# EAGLE design kbd (EAGLE 6.3)
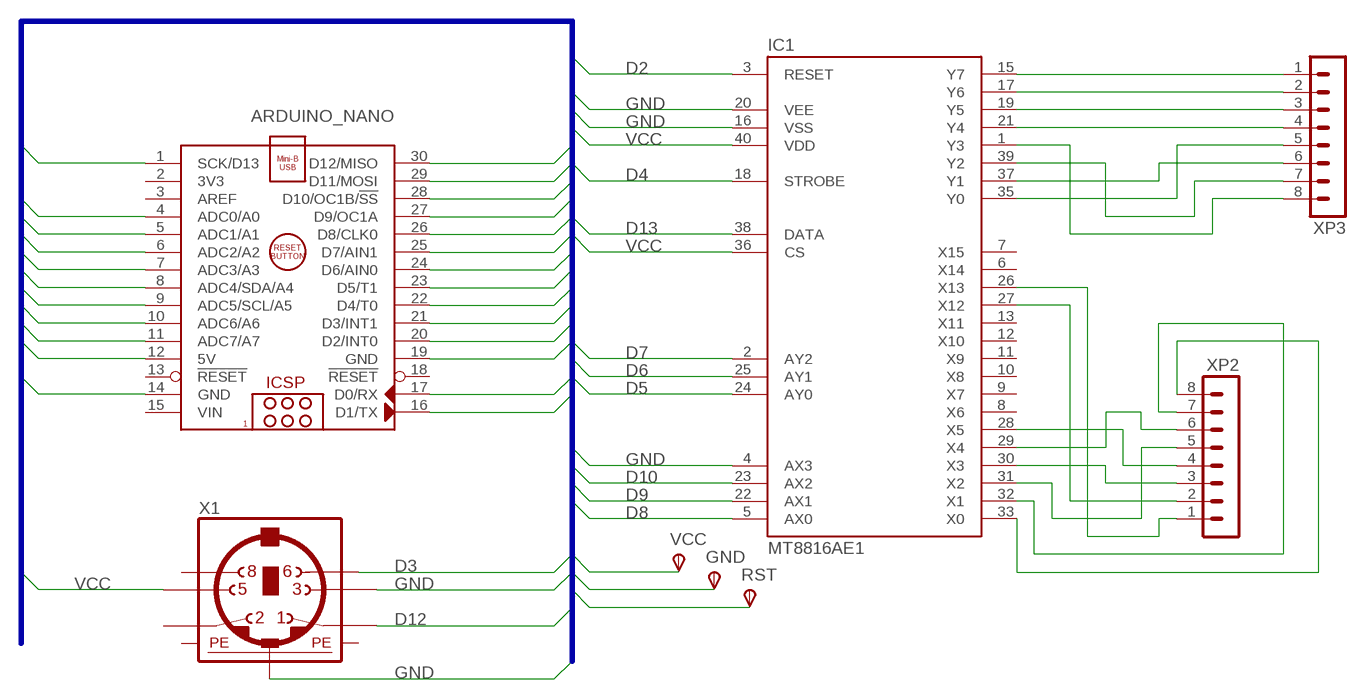
[diagram p0: schematic, sheet 1]

## Parts
ARDUINO_NANO  ARDUINO_NANO  [ARDUINO_NANO]
GND  TPSPAD1-13  [P1-13]
IC1  MT8816AE1  [DIL40]
RST  TPSPAD1-13  [P1-13]
VCC  TPSPAD1-13  [P1-13]
X1  MINI_DIN_6  [M_DIN6]
XP2  MA08-1  [MA08-1]
XP3  MA08-1  [MA08-1]

## Nets
A0: ARDUINO_NANO.4(ADC0/A0) RST.TP(PP)
A1: ARDUINO_NANO.5(ADC1/A1)
A2: ARDUINO_NANO.6(ADC2/A2)
A3: ARDUINO_NANO.7(ADC3/A3)
A4: ARDUINO_NANO.8(ADC4/SDA/A4)
A5: ARDUINO_NANO.9(ADC5/SCL/A5)
A6: ARDUINO_NANO.10(ADC6/A6)
A7: ARDUINO_NANO.11(ADC7/A7)
D0: ARDUINO_NANO.17(D0/RX)
D1: ARDUINO_NANO.16(D1/TX)
D2: ARDUINO_NANO.20(D2/INT0) IC1.3(RESET)
D3: ARDUINO_NANO.21(D3/INT1) X1.6
D4: ARDUINO_NANO.22(D4/T0) IC1.18(STROBE)
D5: ARDUINO_NANO.23(D5/T1) IC1.24(AY0)
D6: ARDUINO_NANO.24(D6/AIN0) IC1.25(AY1)
D7: ARDUINO_NANO.25(D7/AIN1) IC1.2(AY2)
D8: ARDUINO_NANO.26(D8/CLK0) IC1.5(AX0)
D9: ARDUINO_NANO.27(D9/OC1A) IC1.22(AX1)
D10: ARDUINO_NANO.28(D10/OC1B/!SS) IC1.23(AX2)
D11: ARDUINO_NANO.29(D11/MOSI)
D12: ARDUINO_NANO.30(D12/MISO) X1.1
D13: ARDUINO_NANO.1(SCK/D13) IC1.38(DATA)
GND: ARDUINO_NANO.14(GND) ARDUINO_NANO.19(GND) GND.TP(PP) IC1.4(AX3) IC1.16(VSS) IC1.20(VEE) X1.3 X1.SH2(PE2)
N$1: IC1.15(Y7) XP3.1
N$2: IC1.17(Y6) XP3.2
N$3: IC1.19(Y5) XP3.3
N$4: IC1.21(Y4) XP3.4
N$5: IC1.35(Y0) XP3.5
N$6: IC1.37(Y1) XP3.6
N$7: IC1.39(Y2) XP3.7
N$8: IC1.1(Y3) XP3.8
N$9: IC1.27(X12) XP2.2
N$10: IC1.30(X3) XP2.3
N$11: IC1.28(X5) XP2.4
N$12: IC1.31(X2) XP2.5
N$13: IC1.29(X4) XP2.6
N$14: IC1.32(X1) XP2.7
N$15: IC1.33(X0) XP2.8
N$16: IC1.26(X13) XP2.1
VCC: ARDUINO_NANO.12(5V) IC1.36(CS) IC1.40(VDD) VCC.TP(PP) X1.5
Unconnected: ARDUINO_NANO.2(3V3) ARDUINO_NANO.3(AREF) ARDUINO_NANO.13(!RESET) ARDUINO_NANO.18(!RESET) IC1.6(X14) IC1.7(X15) IC1.8(X6) IC1.9(X7) IC1.10(X8) IC1.11(X9) IC1.12(X10) IC1.13(X11) X1.2 X1.8

## Buses
D[0..13],A[0..7],VCC,GND

## Power pins joined to a net without a drawn wire
PE1: X1.SH1(PE1)
PE3: X1.SH3(PE3)
VIN: ARDUINO_NANO.15(VIN)

## Library data of the parts
ARDUINO_NANO = ArduinoNanoV30:ARDUINO_NANO: Arduino Nano V3.0 Module Overview: The Arduino Nano is a small, complete, and breadboard-friendly board based on the ATmega328 (Arduino Nano 3.x) or ATmega168 (Arduino Nano 2.x). It has more or less the same functionality of the Arduino Duemilanove, but in a different package. It lacks only a DC power jack, and works with a Mini-B USB cable instead of a standard one. The Nano was designed and is being produced by Gravitech <http://www.gravitech.us/arna30wiatp.html>. General specifications: Item Value Microcontroller Atmel ATmega168 or ATmega328 Operating Voltage (logic level) 5 V Input Voltage (recommended) 7-12 V Input Voltage (limits) 6-20 V Digital I/O Pins 14 (of which 6 provide PWM output) Analog Input Pins 8 DC Current per I/O Pin 40 mA Flash Memory 16 KB (ATmega168) or 32 KB (ATmega328) of which 2 KB used by bootloader SRAM 1 KB (ATmega168) or 2 KB (ATmega328) EEPROM 512 bytes (ATmega168) or 1 KB (ATmega328) Clock Speed 16 MHz Dimensions (Inches) 0.73" x 1.70" Dimensions (mm) 18mm x 45mm Overall height About 9 mm (not including pins) Weigth 5 g Power: The Arduino Nano can be powered via the Mini-B USB connection, 6-20V unregulated external power supply (pin 30), or 5V regulated external power supply (pin 27). The power source is automatically selected to the highest voltage source. Memory: The ATmega168 has 16 KB of flash memory for storing code (of which 2 KB is used for the bootloader); the ATmega328 has 32 KB, (also with 2 KB used for the bootloader). The ATmega168 has 1 KB of SRAM and 512 bytes of EEPROM (which can be read and written with the EEPROM library); the ATmega328 has 2 KB of SRAM and 1 KB of EEPROM. Input and Output: Each of the 14 digital pins on the Nano can be used as an input or output, using pinMode(), digitalWrite(), and digitalRead() functions. They operate at 5 volts. Each pin can provide or receive a maximum of 40 mA and has an internal pull-up resistor (disconnected by default) of 20-50 kOhms. In addition, some pins have specialized functions. Visit Arduino - ArduinoBoardNano <https://www.arduino.cc/en/Main/ArduinoBoardNano>
GND RST VCC = testpad:TPS: TEST PIN
IC1 = MT8816:MT8816: 8x16 Analog Switch Array
X1 = mini_din:MINI_DIN_6
XP2 XP3 = con-lstb:MA08-1: PIN HEADER; OC_FARNELL: unknown; OC_NEWARK: unknown

## Board
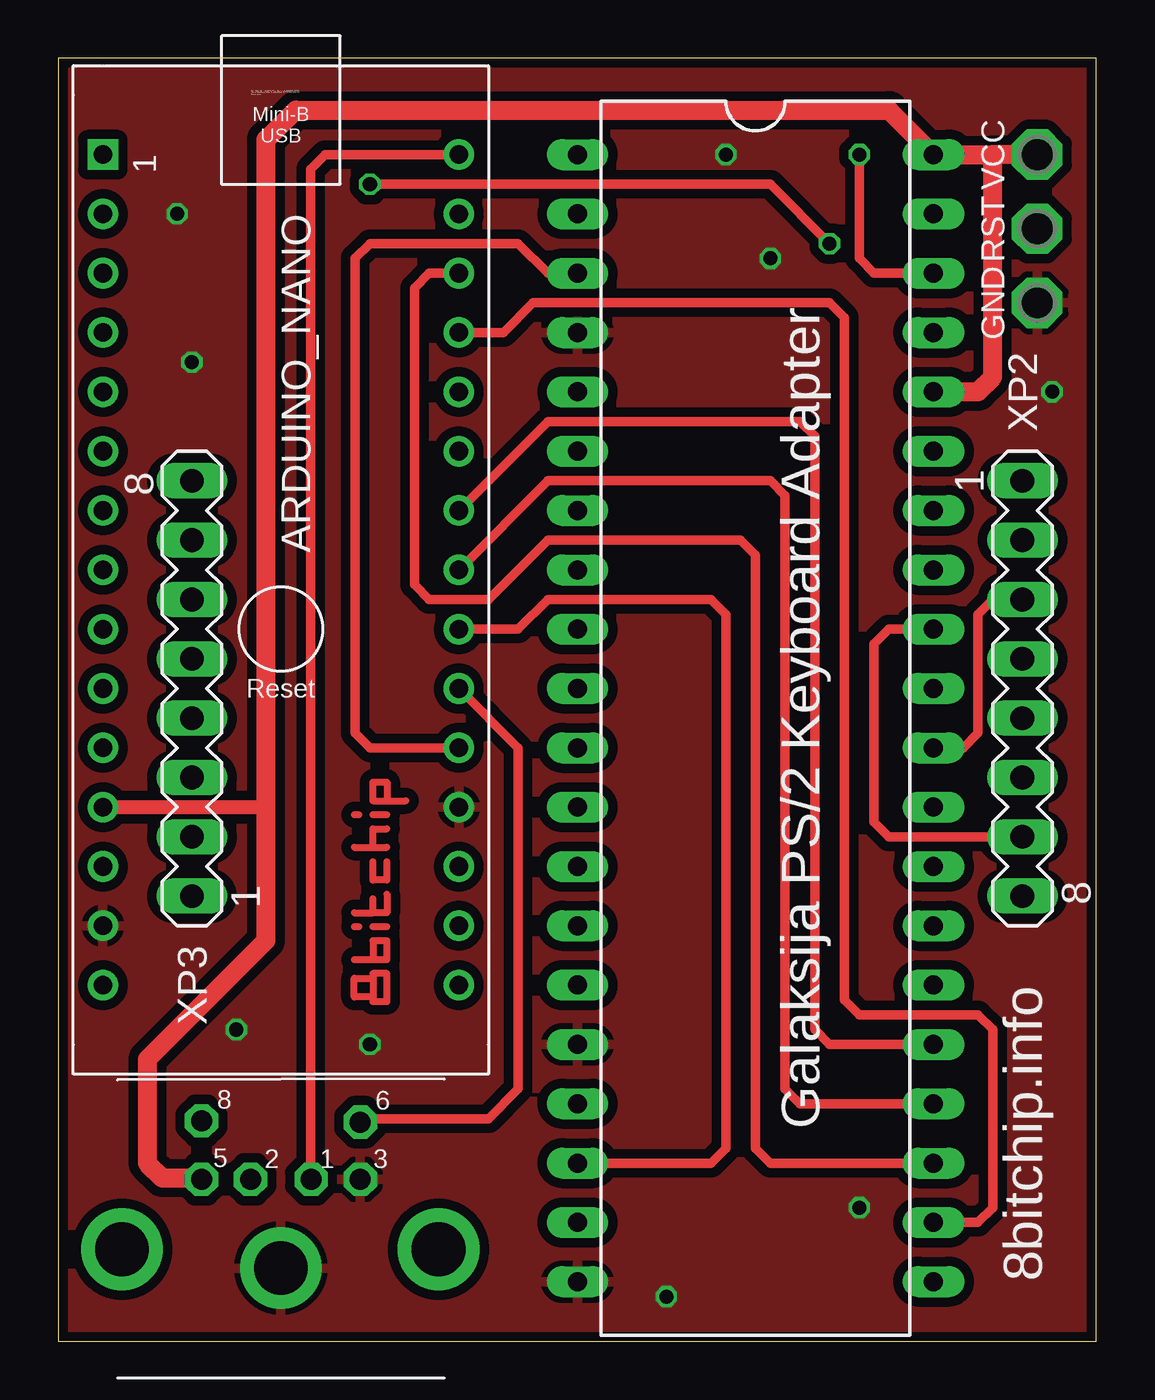
[diagram p1: board, top side]
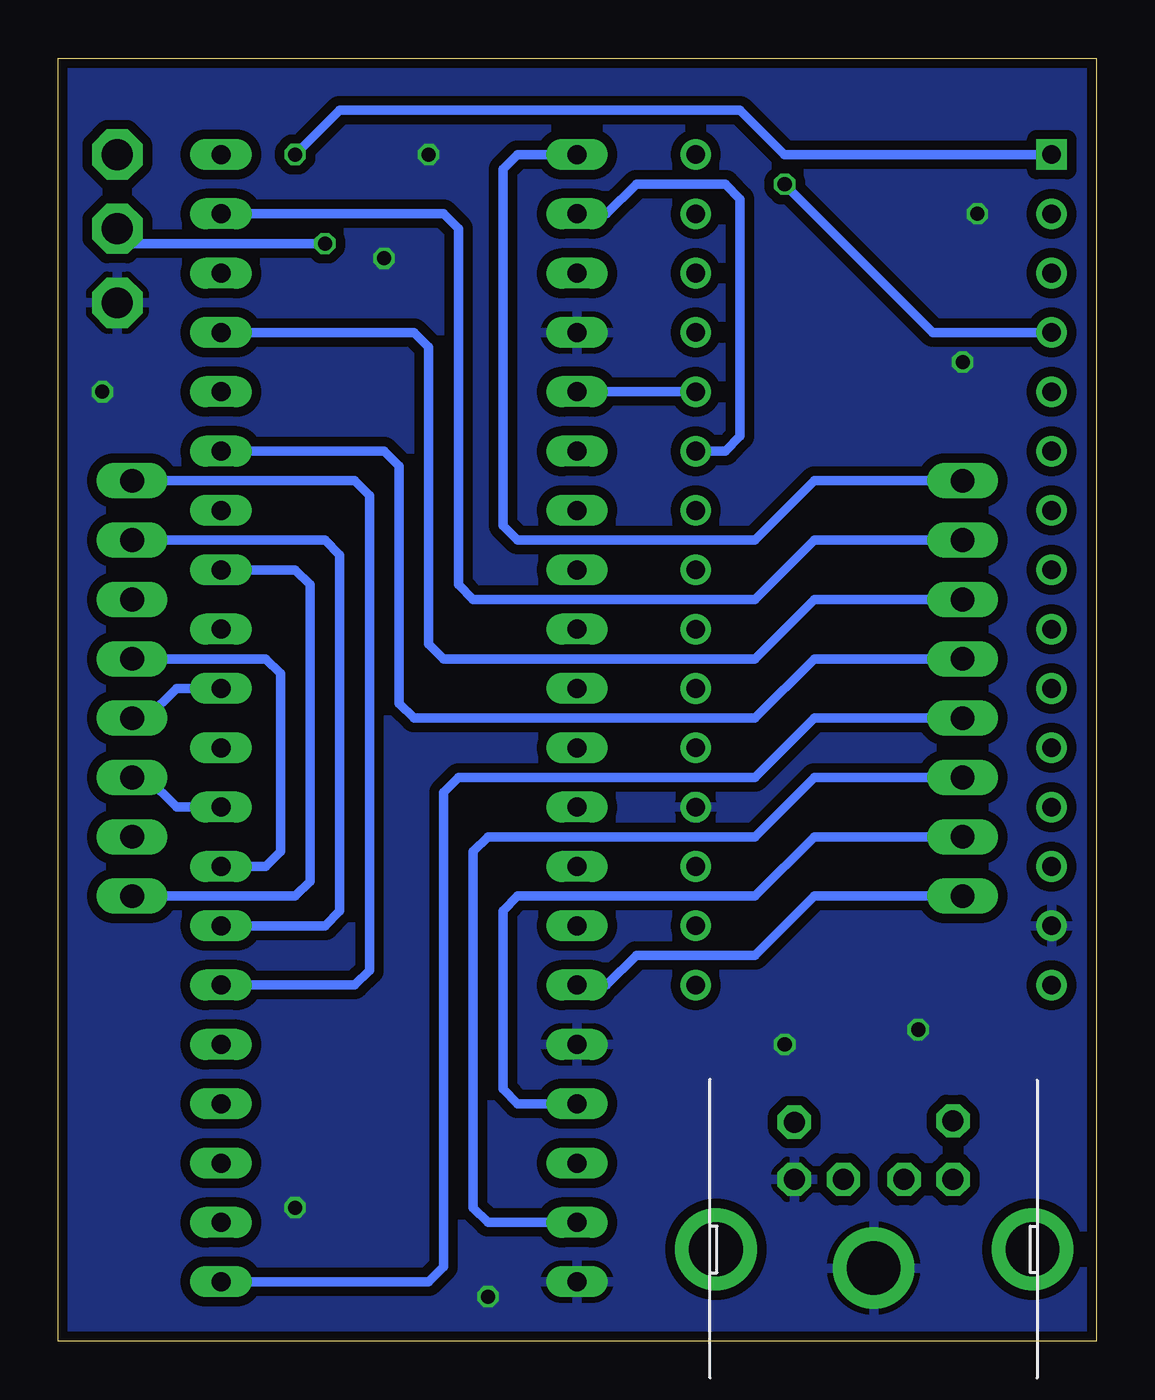
[diagram p2: board, bottom side, seen from below]

Size 44.43 x 54.91 mm. Coordinates in mm from the lower left corner, seen from the top.
Outline: 0,0 44.43,0 44.43,54.91 0,54.91 0,0
Copper layers (1*16): Top 0.035mm / dielectric 1.5mm / Bottom 0.035mm
Design rules "dirt_cheap_dirty_boards.v1": minimum track width 5mil, minimum drill 12mil, track to track 5mil, track to pad 5mil, pad to pad 5mil, via to via 5mil, smd to smd 0mil, copper to edge 10mil, drill to drill 10mil, minimum pad ring 10mil, minimum via ring 6mil, stop-mask expansion 2mil, vias tented up to drill 25mil, thermal gap 10mil

### Footprints (pad centres in the part's own frame; a part is rotated, then mirrored left to right if it is on the bottom)
ARDUINO_NANO = drill 0.8 square: 1 -20.32,-7.62 | drill 0.8: 2 -17.78,-7.62; 3 -15.24,-7.62; 4 -12.7,-7.62; 5 -10.16,-7.62; 6 -7.62,-7.62; 7 -5.08,-7.62; 8 -2.54,-7.62; 9 0,-7.62; 10 2.54,-7.62; 11 5.08,-7.62; 12 7.62,-7.62; 13 10.16,-7.62; 14 12.7,-7.62; 15 15.24,-7.62; 16 15.24,7.62; 17 12.7,7.62; 18 10.16,7.62; 19 7.62,7.62; 20 5.08,7.62; 21 2.54,7.62; 22 0,7.62; 23 -2.54,7.62; 24 -5.08,7.62; 25 -7.62,7.62; 26 -10.16,7.62; 27 -12.7,7.62; 28 -15.24,7.62; 29 -17.78,7.62; 30 -20.32,7.62
P1-13 = drill 1.321 pad 2.159 octagon: TP 0,0
DIL40 = drill 0.813 long: 1 -24.13,-7.62; 2 -21.59,-7.62; 3 -19.05,-7.62; 4 -16.51,-7.62; 5 -13.97,-7.62; 6 -11.43,-7.62; 7 -8.89,-7.62; 8 -6.35,-7.62; 9 -3.81,-7.62; 10 -1.27,-7.62; 11 1.27,-7.62; 12 3.81,-7.62; 13 6.35,-7.62; 14 8.89,-7.62; 15 11.43,-7.62; 16 13.97,-7.62; 17 16.51,-7.62; 18 19.05,-7.62; 19 21.59,-7.62; 20 24.13,-7.62; 21 24.13,7.62; 22 21.59,7.62; 23 19.05,7.62; 24 16.51,7.62; 25 13.97,7.62; 26 11.43,7.62; 27 8.89,7.62; 28 6.35,7.62; 29 3.81,7.62; 30 1.27,7.62; 31 -1.27,7.62; 32 -3.81,7.62; 33 -6.35,7.62; 34 -8.89,7.62; 35 -11.43,7.62; 36 -13.97,7.62; 37 -16.51,7.62; 38 -19.05,7.62; 39 -21.59,7.62; 40 -24.13,7.62
M_DIN6 = drill 0.9 pad 1.422 octagon: 1 -1.3,-3.75; 2 1.3,-3.75; 3 -3.4,-3.75; 5 3.4,-3.75; 6 -3.4,-6.2; 8 3.4,-6.25 | drill 2.3 pad 3.5: SH1 6.8,-0.75; SH2 0,0.05; SH3 -6.75,-0.75
MA08-1 = drill 1.016 long: 1 -8.89,0; 2 -6.35,0; 3 -3.81,0; 4 -1.27,0; 5 1.27,0; 6 3.81,0; 7 6.35,0; 8 8.89,0

### Placement (x,y rotation side)
ARDUINO_NANO  9.53,30.48 270 top
GND  41.91,44.45 90 top
IC1  29.84,26.67 270 top
RST  41.91,47.62 90 top
VCC  41.91,50.8 90 top
X1  9.53,3.17 180 top
XP2  41.27,27.94 270 top
XP3  5.71,27.94 90 top

### Tracks (layer width: path | path; a pad name or v marks a point on that pad's centre or on a via)
A0  (via drill 0.6)
  Top 0.406: v13.34,49.53 30.48,49.53 v33.02,46.99
  Bottom 0.406: ARDUINO_NANO.4 6.99,43.18 v13.34,49.53 | v33.02,46.99 41.27,46.99 RST.TP
D2
  Top 0.406: ARDUINO_NANO.20 13.34,25.4 12.7,26.04 12.7,46.35 13.34,46.99 19.68,46.99 20.95,45.72 IC1.3
D3
  Top 0.406: ARDUINO_NANO.21 19.68,25.4 19.68,10.79 18.41,9.53 13.07,9.53 X1.6
D4
  Top 0.406: ARDUINO_NANO.22 19.68,30.48 20.95,31.75 27.94,31.75 28.57,31.11 28.57,8.26 27.94,7.62 IC1.18
D5
  Top 0.406: IC1.24 31.75,10.16 31.11,10.79 31.11,36.2 30.48,36.83 20.95,36.83 ARDUINO_NANO.23
D6
  Top 0.406: IC1.25 33.02,12.7 32.38,13.34 32.38,38.73 31.75,39.37 20.95,39.37 ARDUINO_NANO.24
D7
  Bottom 0.406: IC1.2 20.95,48.26 19.68,49.53 15.88,49.53 15.24,48.9 15.24,38.73 15.88,38.1 ARDUINO_NANO.25
D8
  Bottom 0.406: ARDUINO_NANO.26 IC1.5
D9
  Top 0.406: ARDUINO_NANO.27 19.05,43.18 20.32,44.45 33.02,44.45 33.66,43.81 33.66,14.61 34.29,13.97 39.37,13.97 40.01,13.34 40.01,5.71 39.37,5.08 IC1.22
D10
  Top 0.406: IC1.23 30.48,7.62 29.84,8.26 29.84,33.66 29.21,34.29 20.95,34.29 18.41,31.75 15.88,31.75 15.24,32.38 15.24,45.09 15.88,45.72 ARDUINO_NANO.28
D12
  Top 0.406: ARDUINO_NANO.30 11.43,50.8 10.79,50.16 10.79,6.96 X1.1
D13  (via drill 0.6)
  Top 0.406: v34.29,50.8 34.29,46.35 34.92,45.72 IC1.38
  Bottom 0.406: ARDUINO_NANO.1 13.34,50.8 15.24,52.7 32.38,52.7 v34.29,50.8
GND  (via drill 0.6)
  other vias: 7.62,13.34 13.34,12.7 5.71,41.91 5.08,48.26 28.57,50.8 30.48,46.35 42.55,40.64 34.29,5.71 26.04,1.91
  pour Bottom (isolate 0.406): -3.17,57.15 52.7,57.15 52.7,-2.54 -3.17,-2.54
  pour Top (isolate 0.406): -6.99,57.15 48.9,57.15 48.9,-2.54 -6.99,-2.54
N$1
  Bottom 0.406: XP3.1 12.06,19.05 14.61,16.51 19.68,16.51 20.95,15.24 IC1.15
N$2
  Bottom 0.406: XP3.2 12.06,21.59 14.61,19.05 24.77,19.05 25.4,18.41 25.4,10.79 24.77,10.16 IC1.17
N$3
  Bottom 0.406: XP3.3 12.06,24.13 14.61,21.59 26.04,21.59 26.67,20.95 26.67,5.71 26.04,5.08 IC1.19
N$4
  Bottom 0.406: XP3.4 12.06,26.67 14.61,24.13 27.3,24.13 27.94,23.5 27.94,3.17 28.57,2.54 IC1.21
N$5
  Bottom 0.406: XP3.5 12.06,29.21 14.61,26.67 29.21,26.67 29.84,27.3 29.84,37.47 30.48,38.1 IC1.35
N$6
  Bottom 0.406: XP3.6 12.06,31.75 14.61,29.21 27.94,29.21 28.57,29.84 28.57,42.55 29.21,43.18 IC1.37
N$7
  Bottom 0.406: XP3.7 12.06,34.29 14.61,31.75 26.67,31.75 27.3,32.38 27.3,47.62 27.94,48.26 IC1.39
N$8
  Bottom 0.406: XP3.8 12.06,36.83 14.61,34.29 24.77,34.29 25.4,34.92 25.4,50.16 24.77,50.8 IC1.1
N$9
  Bottom 0.406: IC1.27 33.02,17.78 32.38,18.41 32.38,33.66 33.02,34.29 XP2.2
N$10
  Top 0.406: IC1.30 38.73,25.4 39.37,26.04 39.37,31.11 40.01,31.75 XP2.3
N$11
  Bottom 0.406: IC1.28 35.56,20.32 34.92,20.95 34.92,28.57 35.56,29.21 XP2.4
N$12
  Bottom 0.406: IC1.31 39.37,27.94 40.64,26.67 XP2.5
N$13
  Bottom 0.406: IC1.29 39.37,22.86 40.64,24.13 XP2.6
N$14
  Top 0.406: IC1.32 35.56,30.48 34.92,29.84 34.92,22.23 35.56,21.59 XP2.7
N$15
  Bottom 0.406: IC1.33 34.29,33.02 33.66,32.38 33.66,19.68 34.29,19.05 XP2.8
N$16
  Bottom 0.406: XP2.1 31.75,36.83 31.11,36.2 31.11,15.88 31.75,15.24 IC1.26
N$17
  Top 0.305: 13.46,15.54 13.46,15.73 14.06,15.73 14.06,14.54 13.46,14.54 13.46,14.73 | 13.46,15.54 13.46,14.73 | 13.46,14.73 12.66,14.73 12.66,15.54 13.46,15.54
N$18
  Top 0.305: 12.66,16.34 13.46,16.34 | 13.46,16.34 14.06,16.34 14.06,17.14 13.46,17.14 13.46,16.34
N$19
  Top 0.305: 14.06,17.73 13.46,17.73
N$20
  Top 0.305: 12.87,17.73 12.66,17.73
N$21
  Top 0.305: 13.46,20.54 13.46,19.73 14.06,19.73 14.06,20.54
N$22
  Top 0.305: 12.66,21.14 13.46,21.14 | 13.46,21.14 14.06,21.14 | 13.46,21.14 13.46,21.93 14.06,21.93
N$23
  Top 0.305: 14.06,22.54 13.46,22.54
N$24
  Top 0.305: 12.87,22.54 12.66,22.54
N$25
  Top 0.305: 14.06,23.14 13.46,23.14 13.46,23.93 14.06,23.93 14.06,23.14 | 14.06,23.14 14.87,23.14
N$26
  Top 0.305: 12.66,18.34 13.46,18.34 | 14.06,19.14 14.06,18.34 13.46,18.34 | 13.46,18.34 13.46,18.93
VCC
  Top 0.61: ARDUINO_NANO.12 8.89,22.86
  Top 0.813: IC1.36 39.37,40.64 40.01,41.27 40.01,50.8 | VCC.TP 40.01,50.8 | 40.01,50.8 IC1.40 35.56,52.7 10.16,52.7 8.89,51.44 8.89,22.86 8.89,17.14 3.81,12.06 3.81,7.62 4.45,6.99 6.07,6.99 X1.5

### Text on the board
tNames: Galaksija PS/2 Keyboard Adapter | 8bitchip.info